# Altium schematic sheet Tiva Pinout.SchDoc
size A
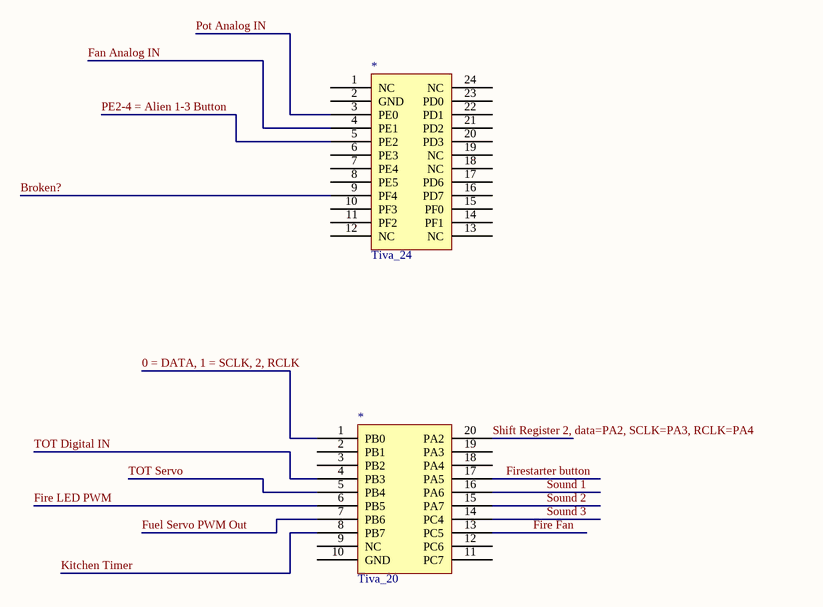
[diagram p0: Tiva Pinout.SchDoc]

## Parts
(Parts that share a designator on the sheet are numbered #1, #2 ... from top to bottom, then left to right.)
*#1  Tiva_24
*#2  Tiva_20

## Nets
0 = DATA, 1 = SCLK, 2, RCLK: *#2.1(PB0)
Broken?: *#1.9(PF4)
Fan Analog IN: *#1.4(PE1)
Fire Fan: *#2.13(PC5)
Fire LED PWM: *#2.6(PB5)
Firestarter button: *#2.17(PA5)
Fuel Servo PWM Out: *#2.7(PB6)
Kitchen Timer: *#2.8(PB7)
PE2-4 = Alien 1-3 Button: *#1.5(PE2)
Pot Analog IN: *#1.3(PE0)
Shift Register 2, data=PA2, SCLK=PA3, RCLK=PA4: *#2.20(PA2)
Sound 1: *#2.16(PA6)
Sound 2: *#2.15(PA7)
Sound 3: *#2.14(PC4)
TOT Digital IN: *#2.4(PB3)
TOT Servo: *#2.5(PB4)

Not connected (* = marked no-connect by the designer): *#1 1(NC) 2(GND) 6(PE3) 7(PE4) 8(PE5) 10(PF3) 11(PF2) 12(NC) 13(NC) 14(PF1) 15(PF0) 16(PD7) 17(PD6) 18(NC) 19(NC) 20(PD3) 21(PD2) 22(PD1) 23(PD0) 24(NC); *#2 2(PB1) 3(PB2) 9(NC) 10(GND) 11(PC7) 12(PC6) 18(PA4) 19(PA3)

## Library data of the parts
*#1 = Tiva_24: Tiva Protection 24 Pin Connector
*#2 = Tiva_20: Tiva Protection 20 Pin Connector